# EAGLE design Circuito Tappingduino 3 Final - ConexionCorrectaPower (EAGLE 9.4.2)
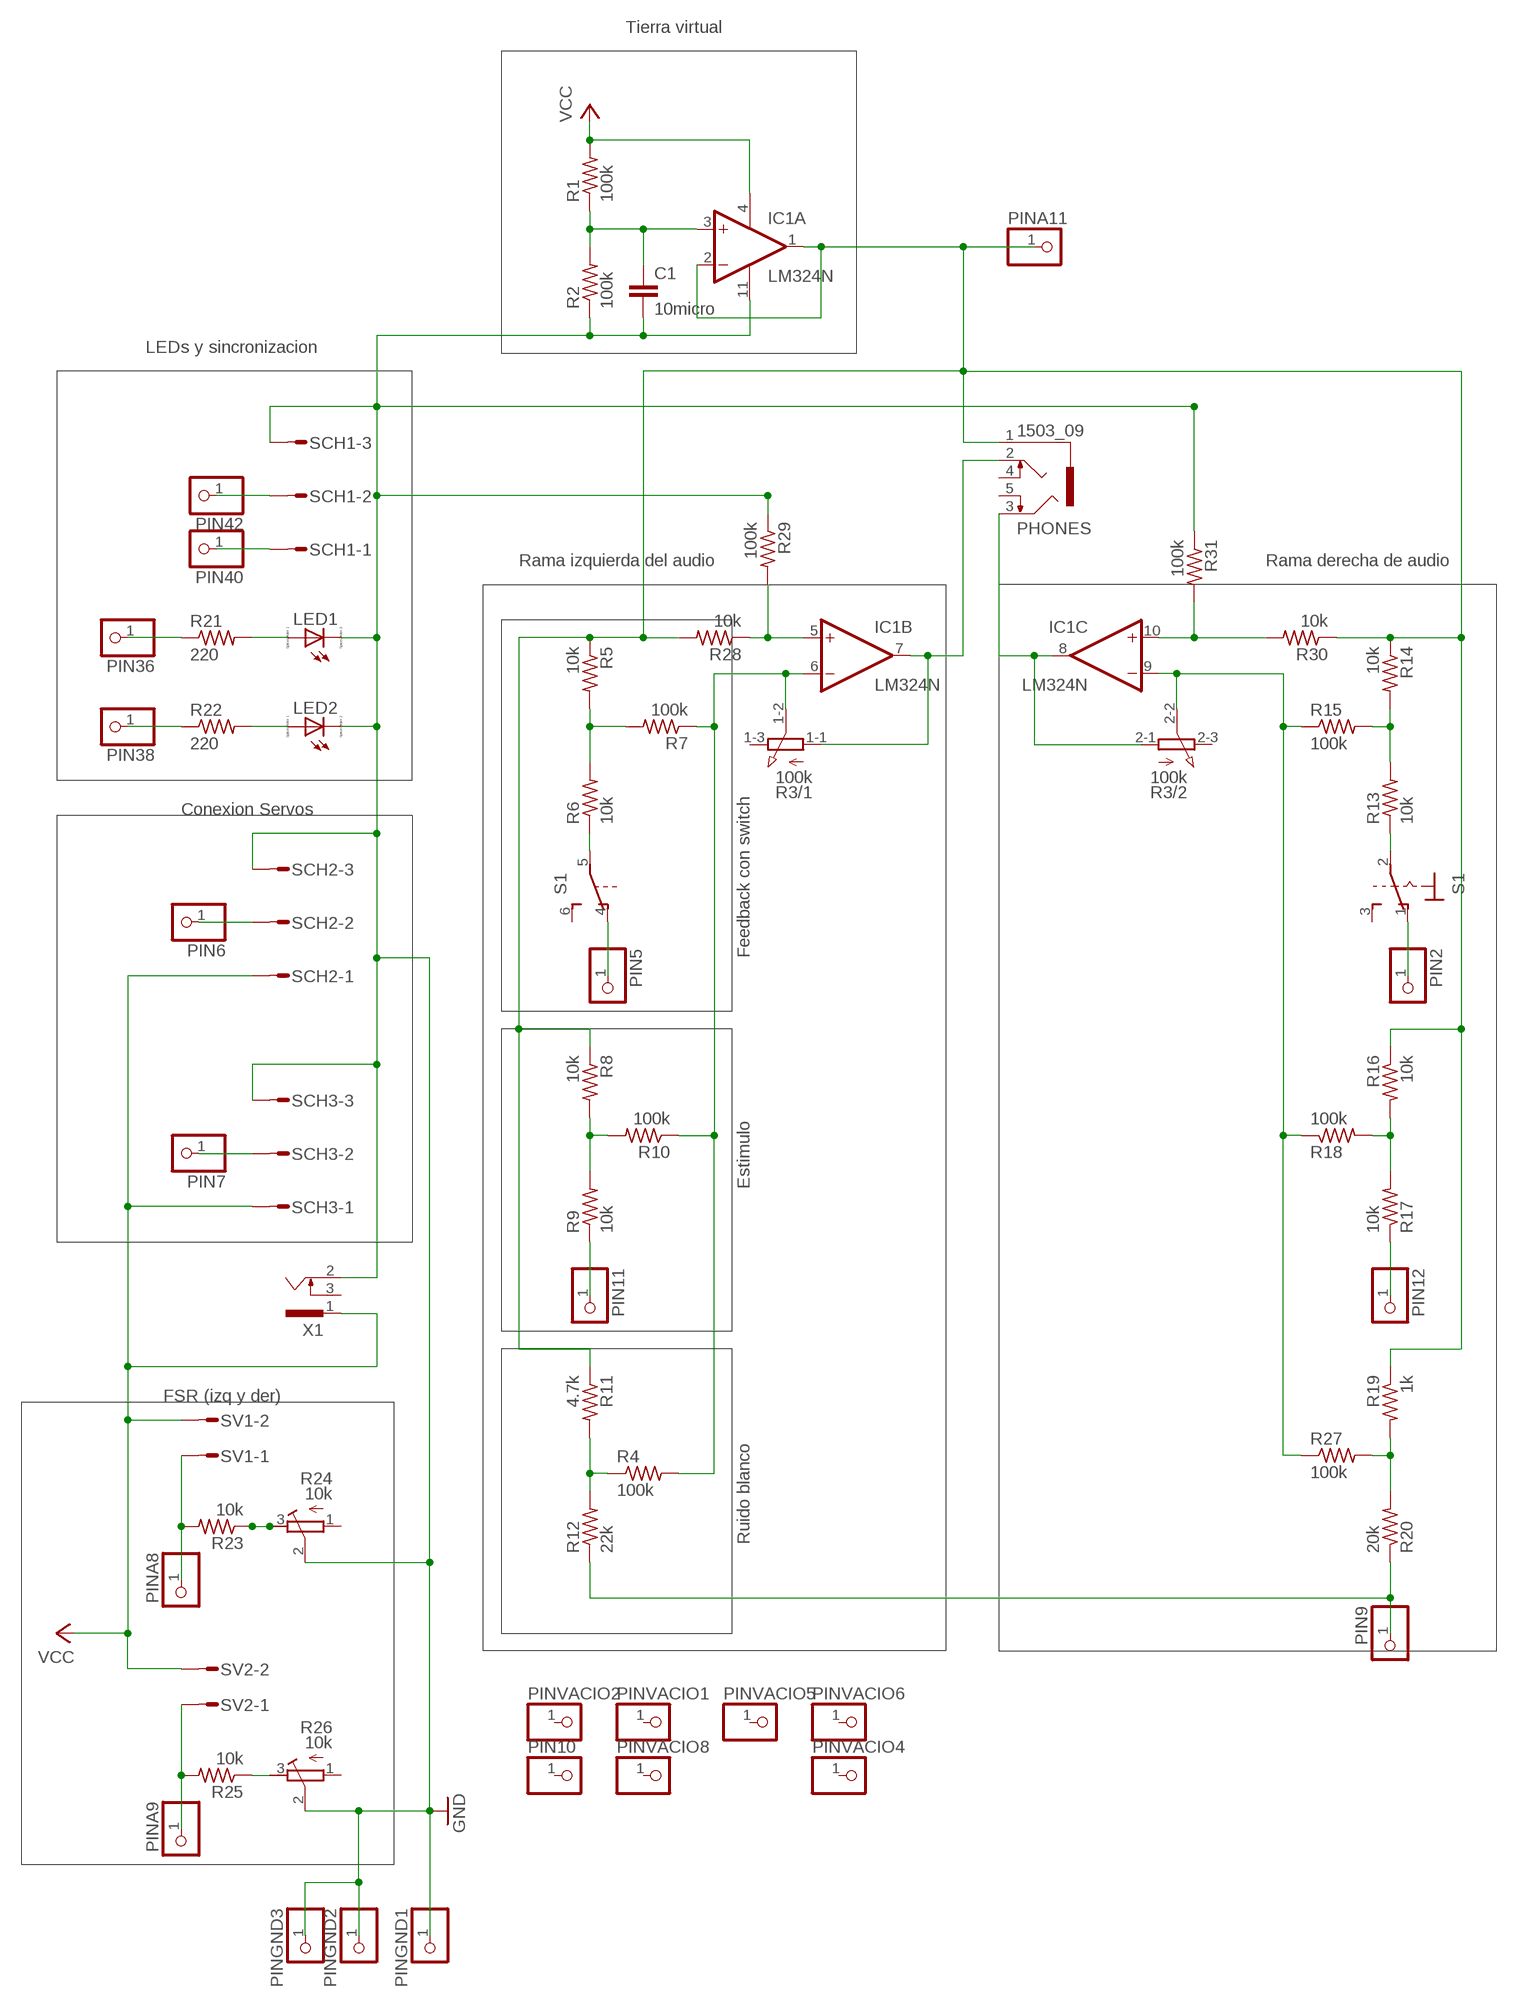
[diagram p0: schematic, sheet 1]

## Parts
C1  10micro  C-EU025-030X050  [C025-030X050]
IC1  LM324N  [DIL14]
LED1  LED_ELD260  [LED_LD260]
LED2  LED_ELD260  [LED_LD260]
PHONES  1503_09  [1503_09]
PIN2  PINHD-1X1  [1X01]
PIN5  PINHD-1X1  [1X01]
PIN6  PINHD-1X1  [1X01]
PIN7  PINHD-1X1  [1X01]
PIN9  PINHD-1X1  [1X01]
PIN10  PINHD-1X1  [1X01]
PIN11  PINHD-1X1  [1X01]
PIN12  PINHD-1X1  [1X01]
PIN36  PINHD-1X1  [1X01]
PIN38  PINHD-1X1  [1X01]
PIN40  PINHD-1X1  [1X01]
PIN42  PINHD-1X1  [1X01]
PINA8  PINHD-1X1  [1X01]
PINA9  PINHD-1X1  [1X01]
PINA11  PINHD-1X1  [1X01]
PINGND1  PINHD-1X1  [1X01]
PINGND2  PINHD-1X1  [1X01]
PINGND3  PINHD-1X1  [1X01]
PINVACIO1  PINHD-1X1  [1X01]
PINVACIO2  PINHD-1X1  [1X01]
PINVACIO4  PINHD-1X1  [1X01]
PINVACIO5  PINHD-1X1  [1X01]
PINVACIO6  PINHD-1X1  [1X01]
PINVACIO8  PINHD-1X1  [1X01]
R1  100k  R-US_0207/7  [0207/7]
R2  100k  R-US_0207/7  [0207/7]
R3  100k  3RP/1610G  [3RP/1610G]
R4  100k  R-US_0207/7  [0207/7]
R5  10k  R-US_0207/7  [0207/7]
R6  10k  R-US_0207/7  [0207/7]
R7  100k  R-US_0207/7  [0207/7]
R8  10k  R-US_0207/7  [0207/7]
R9  10k  R-US_0207/7  [0207/7]
R10  100k  R-US_0207/7  [0207/7]
R11  4.7k  R-US_0207/7  [0207/7]
R12  22k  R-US_0207/7  [0207/7]
R13  10k  R-US_0207/7  [0207/7]
R14  10k  R-US_0207/7  [0207/7]
R15  100k  R-US_0207/7  [0207/7]
R16  10k  R-US_0207/7  [0207/7]
R17  10k  R-US_0207/7  [0207/7]
R18  100k  R-US_0207/7  [0207/7]
R19  1k  R-US_0207/7  [0207/7]
R20  20k  R-US_0207/7  [0207/7]
R21  220  R-US_0207/7  [0207/7]
R22  220  R-US_0207/7  [0207/7]
R23  10k  R-US_0207/7  [0207/7]
R24  10k  R-TRIMM64W  [RTRIM64W]
R25  10k  R-US_0207/7  [0207/7]
R26  10k  R-TRIMM64W  [RTRIM64W]
R27  100k  R-US_0207/7  [0207/7]
R28  10k  R-US_0207/7  [0207/7]
R29  100k  R-US_0207/7  [0207/7]
R30  10k  R-US_0207/7  [0207/7]
R31  100k  R-US_0207/7  [0207/7]
S1  320-938  [320-938]
SCH1  L03P  [L03P]
SCH2  L03P  [L03P]
SCH3  L03P  [L03P]
SV1  L02P  [L02P]
SV2  L02P  [L02P]
X1  SCD-014A  [SCD-014-A]

## Nets
GND: C1.2 IC1.11(P:V-) LED1.K(C) LED2.K(C) PINGND1.1 PINGND2.1 PINGND3.1 R2.1 R24.2(S) R26.2(S) R29.1 R31.1 SCH1.3 SCH2.3 SCH3.3 X1.2
N$1: C1.1 IC1.3(A:+IN) R1.1 R2.2
N$2: R25.1 R26.3(E)
N$3: PIN11.1 R9.1
N$4: IC1.6(B:-IN) R3.1-2(/1:S) R4.2 R7.1 R10.1
N$5: R5.2 R6.2 R7.2
N$6: R6.1 S1.5(B:P)
N$7: PIN5.1 S1.4(B:O)
N$8: IC1.1(A:OUT) IC1.2(A:-IN) PHONES.1 PINA11.1 R5.1 R8.1 R11.1 R14.1 R16.1 R19.1 R28.2 R30.1
N$9: R8.2 R9.2 R10.2
N$10: IC1.10(C:+IN) R30.2 R31.2
N$11: R4.1 R11.2 R12.2
N$13: IC1.9(C:-IN) R3.2-2(/2:S) R15.1 R18.1 R27.1
N$14: R13.2 R14.2 R15.2
N$15: R13.1 S1.2(1:P)
N$16: PIN2.1 S1.1(1:O)
N$17: IC1.5(B:+IN) R28.1 R29.2
N$18: R19.2 R20.2 R27.2
N$19: R16.2 R17.2 R18.2
N$20: PIN12.1 R17.1
N$21: PIN9.1 R12.1 R20.1
N$22: PIN42.1 SCH1.2
N$23: PIN40.1 SCH1.1
N$24: LED1.A R21.2
N$25: PIN36.1 R21.1
N$26: LED2.A R22.2
N$27: PIN38.1 R22.1
N$28: PIN7.1 SCH3.2
N$29: PIN6.1 SCH2.2
N$30: IC1.8(C:OUT) PHONES.3 R3.2-1(/2:A)
N$31: PINA8.1 R23.2 SV1.1
N$32: R23.1 R24.3(E)
N$34: PINA9.1 R25.2 SV2.1
N$37: IC1.7(B:OUT) PHONES.2 R3.1-1(/1:A)
VCC: IC1.4(P:V+) R1.2 SCH2.1 SCH3.1 SV1.2 SV2.2 X1.1
Unconnected: IC1.12(D:+IN) IC1.13(D:-IN) IC1.14(D:OUT) PHONES.4 PHONES.5 PIN10.1 PINVACIO1.1 PINVACIO2.1 PINVACIO4.1 PINVACIO5.1 PINVACIO6.1 PINVACIO8.1 R3.1-3(/1:E) R3.2-3(/2:E) R24.1(A) R26.1(A) S1.3(1:S) S1.6(B:S) X1.3

## Notes on the sheet
- Tierra virtual
- LEDs y sincronizacion
- Rama izquierda del audio | Rama derecha de audio
- Conexion Servos
- Feedback con switch
- Estimulo
- FSR (izq y der)
- Ruido blanco

## Library data of the parts
C1 = rcl:C-EU: CAPACITOR, European symbol; SPICEPREFIX: C
IC1 = linear:LM324: OP AMP; SPICEPREFIX: X
LED1 LED2 = eagle-ltspice:LED_E: LED Source: http://www.osram.convergy.de Source: www.luxeon.com Source: www.kingbright.com; SPICEMODEL: DMOD; SPICEPREFIX: D; SPICETYPE: diode
PHONES = con-lumberg:1503_09: Jack connectors according to JISC 6560, 3.5 mm Klinkeneinbaukupplung nach JISC 6560, 3,5 mm, 3-polig/ stereo, abgewinkelte Ausführung, mit 2 Öffnern und Lötaugen, für Leiterplatten Rückseitenmontage Source: http://www.lumberg.com/Produkte/PDFs/1503_09.pdf; OC_FARNELL: 1243244; OC_NEWARK: unknown; SPICEPREFIX: X
PIN2 PIN5-PIN7 PIN9-PIN12 PIN36 PIN38 PIN40 PIN42 PINA8 PINA9 PINA11 PINGND1-PINGND3 PINVACIO1 PINVACIO2 PINVACIO4-PINVACIO6 PINVACIO8 = pinhead:PINHD-1X1: PIN HEADER; SPICEPREFIX: X
R1 R2 R4-R23 R25 R27-R31 = rcl:R-US_: RESISTOR, American symbol; SPICEPREFIX: R
R3 = pot:3RP/1610G: 16mm Potentiometer two level Source: http://www.alphapotentiometers.net/html/16mm_pot_2.html; SPICEPREFIX: J
R24 R26 = rcl:R-TRIMM: Trimm resistor; SPICEMODEL: X; SPICEPREFIXL: POT
S1 = switch:320-938: TOGGLE SWITCH distributor RS Components
SCH1-SCH3 = con-amp-mt:L03P: AMP MT CONNECTOR; OC_FARNELL: unknown; OC_NEWARK: unknown; SPICEPREFIX: X
SV1 SV2 = con-amp-mt:L02P: AMP MT CONNECTOR; OC_FARNELL: unknown; OC_NEWARK: unknown; SPICEPREFIX: X
X1 = con-shiua-chyuan:SCD-014A: Power Jack 2.5mm; OC_FARNELL: unknown; OC_NEWARK: unknown; SPICEPREFIX: X

## Net classes
1 vcc: width 0.305 mm

## Board
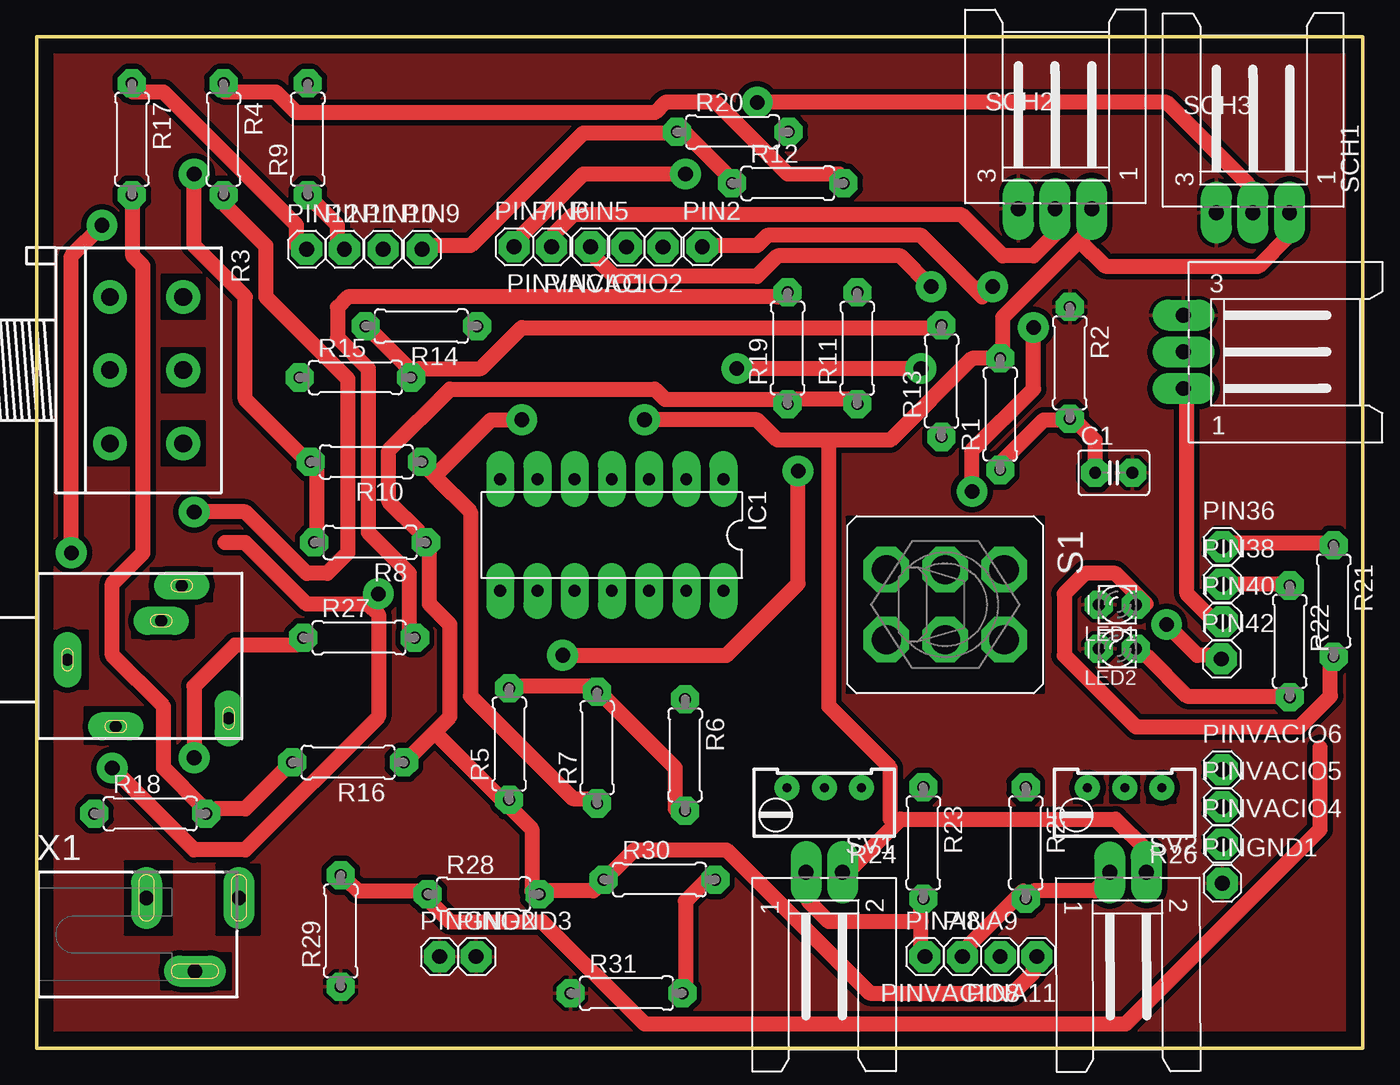
[diagram p1: board, top side]
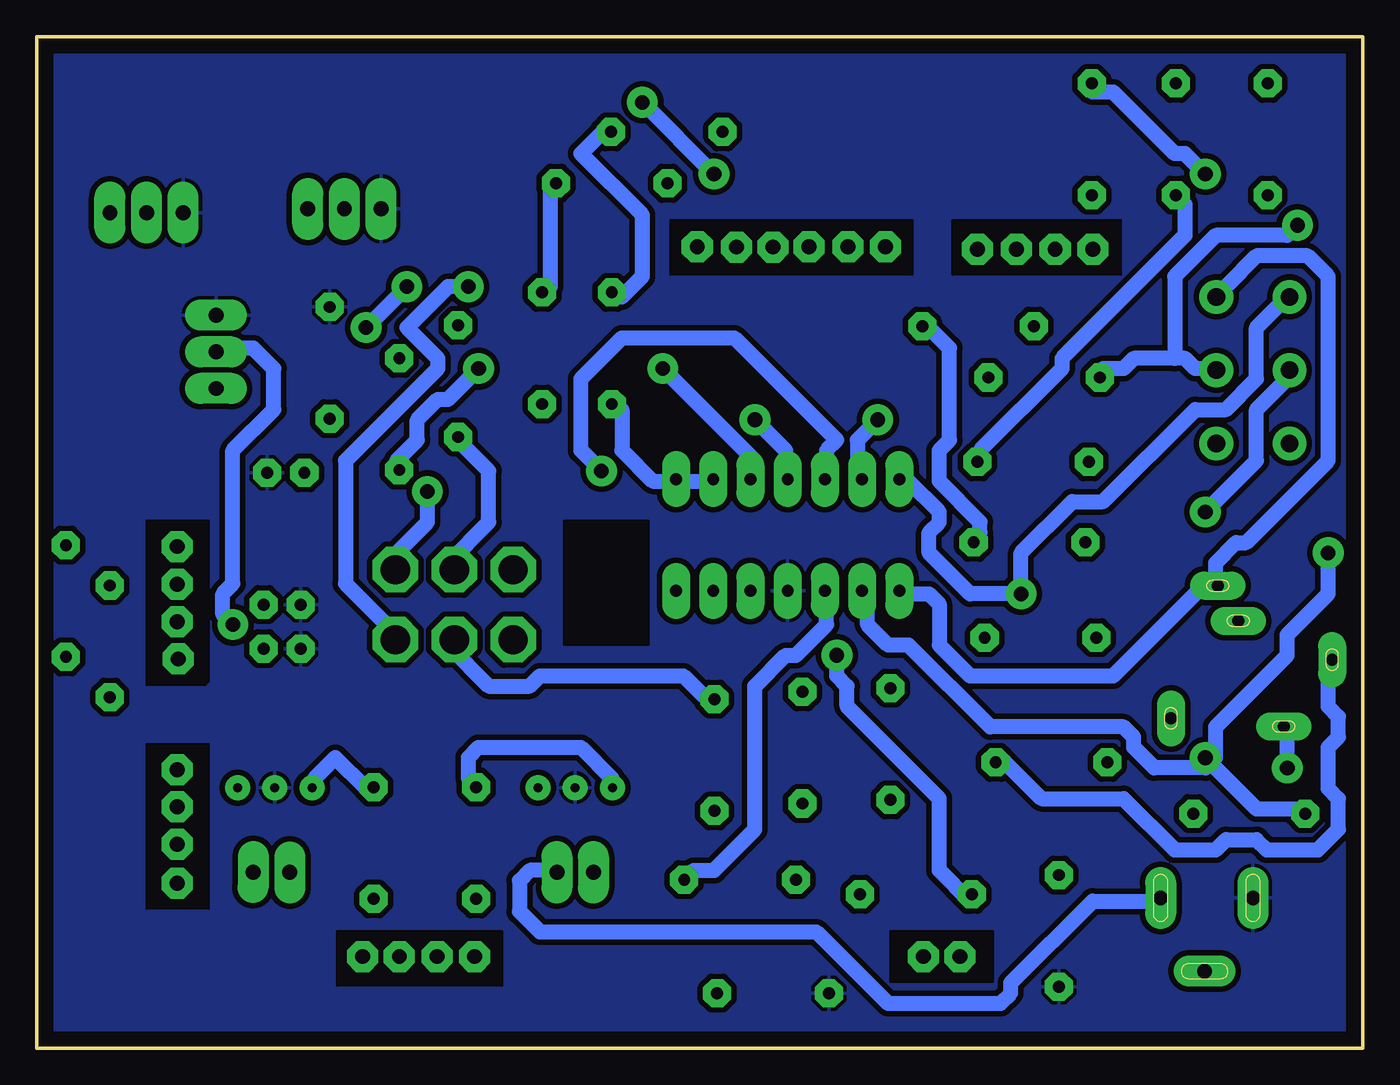
[diagram p2: board, bottom side, seen from below]

Size 90.5 x 69 mm. Coordinates in mm from the lower left corner, seen from the top.
Outline: 0,0 90.5,0 90.5,69 0,69 0,0
Copper layers (1*16): Top 0.035mm / dielectric 1.5mm / Bottom 0.035mm
Design rules "default *": minimum track width 40mil, minimum drill 1mm, track to track 15mil, track to pad 15mil, pad to pad 15mil, via to via 15mil, smd to smd 8mil, copper to edge 40mil, drill to drill 16mil, minimum pad ring 0.55mm, minimum via ring 0.55mm, stop-mask expansion 4mil, vias tented up to drill 0mil, thermal gap 10mil
tRestrict: area 50.2,16.8 to 52.2,18.8; area 52.8,16.8 to 54.8,18.8; area 55.2,16.8 to 57.2,18.8; area 70.8,16.8 to 72.8,18.8; area 73.2,16.8 to 75.2,18.8; area 75.8,16.8 to 77.8,18.8; area 28.2,19.2 to 28.2,22.8; area 30.2,36.8 to 48.2,41.2; area 30.2,29 to 48.2,33.2; area 3.2,49.8 to 6.5,52.8; area 8.5,49.8 to 11.5,52.8; area 3.2,44.8 to 6.5,47.8; 12 more areas
bRestrict: area 25.2,4.5 to 32.2,8; area 58.8,4.2 to 70,8; area 78.8,9.5 to 83,20.8; area 78.8,24.8 to 83,36; area 16.5,52.8 to 28,56.5; area 30.8,52.8 to 47.2,56.5; area 48.8,27.5 to 54.5,36
vRestrict: area 63.8,57.5 to 88.8,68.8; area 78.5,41.5 to 90.8,53.8; area 48.8,0.2 to 58.5,11.8; area 69.5,0.2 to 79.5,11.8; area 48.8,14.2 to 58.8,19.2; area 69.2,14.2 to 79.2,19.2; area 0.2,37.8 to 12.8,54.8; area 30.2,33.2 to 48.2,36.8; area 0.2,21 to 14,32.2; area 0,3.5 to 13.8,12

### Footprints (pad centres in the part's own frame; a part is rotated, then mirrored left to right if it is on the bottom)
C025-030X050 = drill 0.813 octagon: 1 -1.27,0; 2 1.27,0
DIL14 = drill 0.813 long: 1 -7.62,-3.81; 2 -5.08,-3.81; 3 -2.54,-3.81; 4 0,-3.81; 5 2.54,-3.81; 6 5.08,-3.81; 7 7.62,-3.81; 8 7.62,3.81; 9 5.08,3.81; 10 2.54,3.81; 11 0,3.81; 12 -2.54,3.81; 13 -5.08,3.81; 14 -7.62,3.81
LED_LD260 = drill 0.813 octagon: A -1.27,0; K 1.27,0
1503_09 = drill 0.8 pad 1.2 long: 1 0,-2.1; 2 -4.55,-5.4; 3 5.05,-9.9; 4 -4,-13.1; 5 2.65,-8.5
1X01 = drill 1.016 octagon: 1 0,0
0207/7 = drill 0.813 octagon: 1 -3.81,0; 2 3.81,0
3RP/1610G = drill 1.2 pad 2.184: 1-1 -5,0; 1-2 0,0; 1-3 5,0; 2-1 -5,5; 2-2 0,5; 2-3 5,5
RTRIM64W = drill 0.61: 1 1.27,-2.54; 2 1.27,0; 3 1.27,2.54
320-938 = drill 2.007 octagon: 1 -2.388,4.013; 2 -2.388,0; 3 -2.388,-4.013; 4 2.388,4.013; 5 2.388,0; 6 2.388,-4.013
L03P = drill 1.016 long: 1 2.5,-6.25; 2 0,-6.25; 3 -2.5,-6.25
L02P = drill 1.016 long: 1 1.25,-6.25; 2 -1.25,-6.25
SCD-014-A = drill 1 pad 2 long: 1 -2.5,13.8; 2 -2.5,7.5; 3 2.5,10.8

### Placement (x,y rotation side)
C1  73.5,39.25 0 top
IC1  39.25,35 180 top
LED1  73.75,30.25 180 top
LED2  73.75,27.25 180 top
PHONES  0,26.5 90 top
PIN2  45.42,54.67 0 top
PIN5  37.8,54.67 0 top
PIN6  35.13,54.67 0 top
PIN7  32.59,54.67 0 top
PIN9  26.3,54.5 0 top
PIN10  23.63,54.5 0 top
PIN11  21,54.5 0 top
PIN12  18.42,54.5 0 top
PIN36  80.9,34.22 0 top
PIN38  80.9,31.64 0 top
PIN40  80.9,29.09 0 top
PIN42  80.85,26.55 0 top
PINA8  60.62,6.25 0 top
PINA9  63.17,6.25 0 top
PINA11  68.25,6.25 180 top
PINGND1  80.9,11.25 0 top
PINGND2  27.5,6.25 0 top
PINGND3  30,6.25 0 top
PINVACIO1  40.25,54.65 180 top
PINVACIO2  42.75,54.65 180 top
PINVACIO4  80.9,13.92 0 top
PINVACIO5  80.9,16.47 0 top
PINVACIO6  80.9,19 0 top
PINVACIO8  65.75,6.25 180 top
R1  65.75,43.25 90 top
R2  70.5,46.75 270 top
R3  5,46.25 270 top
R4  12.75,62 270 top
R5  32.25,20.75 90 top
R6  44.25,20 270 top
R7  38.25,20.5 90 top
R8  22.75,34.5 180 top
R9  18.5,62 90 top
R10  22.5,40 180 top
R11  56,47.75 90 top
R12  51.25,59 0 top
R13  61.75,45.5 90 top
R14  26.25,49.25 180 top
R15  21.75,45.75 0 top
R16  21.25,19.5 180 top
R17  6.5,62 270 top
R18  7.75,16 0 top
R19  51.25,47.75 90 top
R20  47.5,62.5 0 top
R21  88.5,30.5 270 top
R22  85.5,27.75 270 top
R23  60.5,14 270 top
R24  53.75,16.5 90 top
R25  67.5,14 270 top
R26  74.25,16.5 90 top
R27  22,28 0 top
R28  30.5,10.5 0 top
R29  20.75,8 90 top
R30  42.5,11.5 0 top
R31  40.25,3.75 0 top
S1  62,30.25 270 top
SCH1  84.5,47.5 270 top
SCH2  69.5,63.5 0 top
SCH3  83,63.25 0 top
SV1  53.75,5.75 180 top
SV2  74.5,5.75 180.2 top
X1  0,7.75 270 top

### Tracks (layer width: path | path; a pad name or v marks a point on that pad's centre or on a via)
GND
  pour Top: 0,0 90.5,0 90.5,69 0,69
  pour Top: 0,69 0,0 90.5,0 90.5,69
  pour Bottom: 0,69 0,0 90.5,0 90.5,69
N$1  (via drill 1)
  Top 1.016: C1.1 72.22,39.37 72.22,41.47 70.82,42.87 R2.2 70.12,42.87 68.72,42.87 65.93,40.07 R1.1 | v60.34,46.36 v47.77,46.36
  Bottom 1.016: v47.77,46.36 41.48,40.07 41.48,39.37 IC1.3 | v60.34,46.36 62.44,44.26 63.14,44.26 64.53,42.87 64.53,41.47 65.93,40.07 R1.1
N$2
  Bottom 1.016: R26.3 71.52,18.42 70.12,19.82 68.03,17.72 R25.1
N$3
  Top 1.016: R9.1 19.13,57.53 20.53,56.14 20.53,54.74 PIN11.1
N$4  (via drill 1)
  Top 1.016: 27.16,39.02 26.81,39.37 R10.1 | 27.16,39.02 29.61,36.58 29.61,24.01 36.59,17.02 37.99,17.02 R7.1 | v33.1,42.87 31.01,42.87 27.16,39.02 | v10.75,36.58 14.24,36.58 18.43,32.39 19.83,32.39 21.23,33.78 21.23,45.66 15.64,51.25 15.64,54.74 12.84,57.53 R4.2
  Bottom 1.016: v33.1,42.87 34.5,41.47 34.5,39.37 IC1.6 | R10.1 26.12,40.07 26.12,40.77 20.53,46.36 20.53,47.06 12.15,55.44 12.15,57.53 R4.2 | v10.75,36.58 7.26,40.07 7.26,43.56 5.16,45.66 R3.1-2
N$5
  Top 1.016: R6.2 43.58,16.32 43.58,19.12 38.69,24.01 R7.2 37.99,24.7 32.4,24.7 R5.2
N$6
  Bottom 1.016: R6.1 44.28,24.01 44.98,24.01 46.37,25.4 56.15,25.4 56.85,24.7 59.64,24.7 62.44,27.5 S1.5
N$7  (via drill 1)
  Top 1.016: v61.04,51.95 58.94,54.04 50.56,54.04 49.17,52.65 39.39,52.65 37.99,54.04 PIN5.1
  Bottom 1.016: v61.04,51.95 62.44,51.95 65.23,49.15 63.14,47.06 63.14,46.36 69.42,40.07 69.42,31.69 66.63,28.9 66.63,28.2 S1.4
N$8
  Top 1.016: PINA11.1 68.03,5.85 68.03,5.15 66.63,3.75 56.85,3.75 47.07,13.53 40.78,13.53 39.39,12.13 R30.1 38.69,11.43 37.99,10.73 34.5,10.73 R28.2 33.8,10.73 33.8,14.93 32.4,16.32 R5.1 31.7,17.02 27.16,21.56 | R11.1 55.45,44.26 51.26,44.26 R19.1 50.56,44.26 42.88,44.26 42.18,44.96 28.21,44.96 24.02,40.77 24.02,37.28 26.12,35.18 R8.1 26.81,34.48 26.81,30.29 28.21,28.9 28.21,22.61 27.16,21.56 | 27.16,21.56 25.42,19.82 R16.1
  Bottom 1.016: IC1.2 44.98,38.67 46.37,38.67 IC1.1 47.07,38.67 48.47,38.67 50.56,40.77 50.56,43.56 R19.1 | PHONES.1 2.37,26.1 2.37,23.31 1.67,22.61 1.67,21.21 2.37,20.51 2.37,17.72 1.67,17.02 1.67,14.93 3.07,13.53 6.56,13.53 7.26,14.23 9.35,14.23 10.05,13.53 12.84,13.53 16.34,17.02 21.92,17.02 24.72,19.82 R16.1 | R14.1 29.61,49.15 28.21,47.76 28.21,41.47 28.91,40.77 28.91,38.67 26.12,35.88 26.12,35.18 R8.1
N$9  (via drill 1)
  Top 1.016: R8.2 19.13,35.18 19.13,39.37 R10.2 18.43,40.07 14.24,44.26 14.24,51.25 10.75,54.74 v10.75,59.63
  Bottom 1.016: v10.75,59.63 12.15,61.03 12.84,61.03 17.04,65.22 18.43,65.22 R9.2
N$10
  Top 1.016: R31.2 44.28,3.75 44.28,10.04 45.67,11.43 R30.2
  Bottom 1.016: IC1.10 36.59,30.99 36.59,28.9 38.69,26.8 39.39,26.8 41.48,24.7 41.48,14.93 44.28,12.13 45.67,12.13 R30.2
N$11
  Top 1.016: R4.1 12.84,65.22 16.34,65.22 17.73,63.82 42.18,63.82 42.88,64.52 46.37,64.52 51.26,59.63 54.75,59.63 R12.2
  Bottom 1.016: R11.2 55.45,51.95 55.45,58.93 R12.2
N$13  (via drill 1)
  Top 1.016: v10.75,19.82 10.75,24.7 13.54,27.5 17.73,27.5 R27.1 | v4.46,56.14 2.37,54.04 v2.37,33.78
  Bottom 1.016: 12.84,47.06 12.15,47.06 11.45,46.36 10.05,46.36 R3.2-2 | 12.84,47.06 15.64,47.06 16.34,46.36 17.73,46.36 R15.1 | v10.75,19.82 7.26,16.32 4.46,16.32 R18.1 | IC1.9 33.8,30.99 33.8,28.9 32.4,27.5 31.01,27.5 25.42,21.91 16.34,21.91 15.64,21.21 15.64,20.51 14.24,19.12 10.75,19.12 v10.75,19.82 | 12.84,47.06 12.84,52.65 10.05,55.44 5.16,55.44 v4.46,56.14 | v2.37,33.78 2.37,30.99 5.16,28.2 5.16,26.8 10.05,21.91 10.05,19.82 v10.75,19.82
N$14
  Top 1.016: R14.2 22.62,49.15 25.42,46.36 R15.2 26.12,46.36 30.31,46.36 33.1,49.15 61.74,49.15 R13.2
N$15
  Bottom 1.016: R13.1 61.74,41.47 59.64,39.37 59.64,35.88 62.44,33.09 S1.2
N$16  (via drill 1)
  Top 1.016: 64.53,51.25 64.18,51.6 | 64.18,51.6 60.34,55.44 49.87,55.44 49.17,54.74 45.67,54.74 PIN2.1 | v68.03,49.15 68.03,44.96 63.83,40.77 v63.83,37.98 | v65.23,51.95 64.53,51.95 64.18,51.6
  Bottom 1.016: v63.83,37.98 63.83,35.88 66.63,33.09 S1.1 | v65.23,51.95 v68.03,49.15
N$17  (via drill 1)
  Top 1.016: R29.2 21.23,11.43 21.92,10.73 26.12,10.73 R28.1 26.81,10.04 28.21,8.64 34.5,8.64 41.48,1.65 74.31,1.65 87.58,14.93 87.58,20.51 | v51.96,39.37 51.96,31.69 47.07,26.8 v35.9,26.8
  Bottom 1.016: v51.96,39.37 53.36,40.77 53.36,45.66 50.56,48.45 42.88,48.45 35.9,41.47 36.59,40.77 36.59,39.37 IC1.5 | v35.9,26.8 35.9,25.4 35.2,24.7 35.2,23.31 28.91,17.02 28.91,12.13 26.81,10.04 R28.1
N$18
  Top 1.016: R27.2 25.42,28.2 25.42,32.39 22.62,35.18 22.62,46.36 20.53,48.45 20.53,50.55 21.23,51.25 50.56,51.25 R19.2
  Bottom 1.016: R20.2 51.96,62.42 53.36,61.03 49.17,56.84 49.17,52.65 50.56,51.25 R19.2
N$19
  Top 1.016: R16.2 17.04,19.12 14.24,16.32 12.15,16.32 R18.2 11.45,16.32 8.65,19.12 8.65,23.31 5.16,26.8 5.16,31.69 7.26,33.78 7.26,53.34 6.56,54.04 6.56,57.53 R17.2
N$20
  Top 1.016: R17.1 6.56,65.22 8.65,65.22 17.73,56.14 17.73,54.74 PIN12.1
N$21
  Top 1.016: R12.1 47.07,59.63 44.28,62.42 R20.1 43.58,62.42 37.29,62.42 29.61,54.74 26.81,54.74 PIN9.1
N$22  (via drill 1)
  Top 1.016: v77.11,28.9 79.2,26.8 80.6,26.8 PIN42.1
  Bottom 1.016: v77.11,28.9 77.81,29.59 77.81,30.99 77.11,31.69 77.11,40.77 74.31,43.56 74.31,46.36 75.71,47.76 77.81,47.76 SCH1.2
N$23
  Top 1.016: SCH1.1 78.5,44.96 78.5,30.99 80.6,28.9 PIN40.1
N$24
  Top 1.016: R21.2 88.28,26.1 88.28,24.01 86.19,21.91 75.01,21.91 70.12,26.8 70.12,30.99 71.52,32.39 73.61,32.39 75.71,30.29 LED1.A
N$25
  Top 1.016: R21.1 88.28,34.48 81.3,34.48 PIN36.1
N$26
  Top 1.016: R22.2 85.49,24.01 78.5,24.01 75.71,26.8 LED2.A
N$27
  Top 1.016: R22.1 85.49,31.69 81.3,31.69 PIN38.1
N$28  (via drill 1)
  Top 1.016: v44.28,59.63 37.29,59.63 33.1,55.44 33.1,54.74 PIN7.1 | v49.17,64.52 77.11,64.52 82.69,58.93 82.69,57.53 SCH3.2
  Bottom 1.016: v49.17,64.52 v44.28,59.63
N$29
  Top 1.016: PIN6.1 35.2,54.74 35.2,55.44 36.59,56.84 63.14,56.84 65.93,54.04 68.03,54.04 69.42,55.44 69.42,56.84 SCH2.2
N$30
  Bottom 1.016: 10.05,31.69 10.75,31.69 17.04,25.4 26.81,25.4 28.91,27.5 28.91,30.29 29.61,30.99 31.01,30.99 IC1.8 | 10.05,31.69 10.05,33.09 8.65,34.48 7.95,34.48 2.37,40.07 2.37,52.65 3.76,54.04 7.26,54.04 9.35,51.95 R3.2-1 | 10.05,31.69 PHONES.3
N$31
  Top 1.016: 60.34,8.64 60.34,6.54 PINA8.1 | 60.34,8.64 60.34,10.04 R23.2 | 60.34,8.64 54.06,8.64 52.66,10.04 52.66,11.43 SV1.1
N$32
  Bottom 1.016: R24.3 51.26,18.42 53.36,20.51 60.34,20.51 61.04,19.82 61.04,18.42 R23.1
N$34
  Top 1.016: SV2.1 72.92,11.43 72.22,10.73 68.03,10.73 R25.2 67.33,10.73 63.14,6.54 PINA9.1
N$37  (via drill 1)
  Top 1.016: v5.16,19.12 10.75,13.53 14.24,13.53 23.32,22.61 23.32,29.59 22.97,29.94 | 12.84,34.48 14.24,34.48 18.43,30.29 22.62,30.29 22.97,29.94 | v23.32,30.99 23.32,30.29 22.97,29.94
  Bottom 1.016: v5.16,19.12 5.16,21.91 PHONES.2 | IC1.7 31.01,38.67 28.91,36.58 28.91,35.88 29.61,35.18 29.61,33.78 26.81,30.99 v23.32,30.99 23.32,33.78 19.83,37.28 17.73,37.28 11.45,43.56 9.35,43.56 7.26,45.66 7.26,49.15 5.16,51.25 R3.1-1
VCC  (via drill 1)
  Top 1.016: v41.48,42.87 49.17,42.87 50.56,41.47 54.06,41.47 | 54.06,41.47 58.25,41.47 63.83,47.06 65.23,47.06 R1.2 65.93,47.76 65.93,49.85 71.17,55.09 | 71.17,55.09 71.52,55.44 71.52,56.84 SCH2.1 | 71.17,55.09 72.92,53.34 83.39,53.34 85.49,55.44 85.49,56.84 SCH3.1 | 58.6,15.28 55.45,12.13 SV1.2 | 58.6,15.28 58.94,15.62 73.61,15.62 75.71,13.53 75.71,12.13 SV2.2 | 54.06,41.47 54.06,23.31 58.25,19.12 58.25,15.62 58.6,15.28
  Bottom 1.016: v41.48,42.87 39.39,40.77 39.39,39.37 IC1.4 | X1.1 14.24,10.04 18.43,10.04 24.02,4.45 24.02,3.75 24.72,3.05 32.4,3.05 37.29,7.94 56.15,7.94 57.55,9.34 57.55,11.43 56.85,12.13 55.45,12.13 SV1.2